# Altium schematic sheet Sheet1.SchDoc: 8-Port USB Video Switch
size B; Author: Micah Dowty; DrawnBy: Micah Dowty; Revision: A
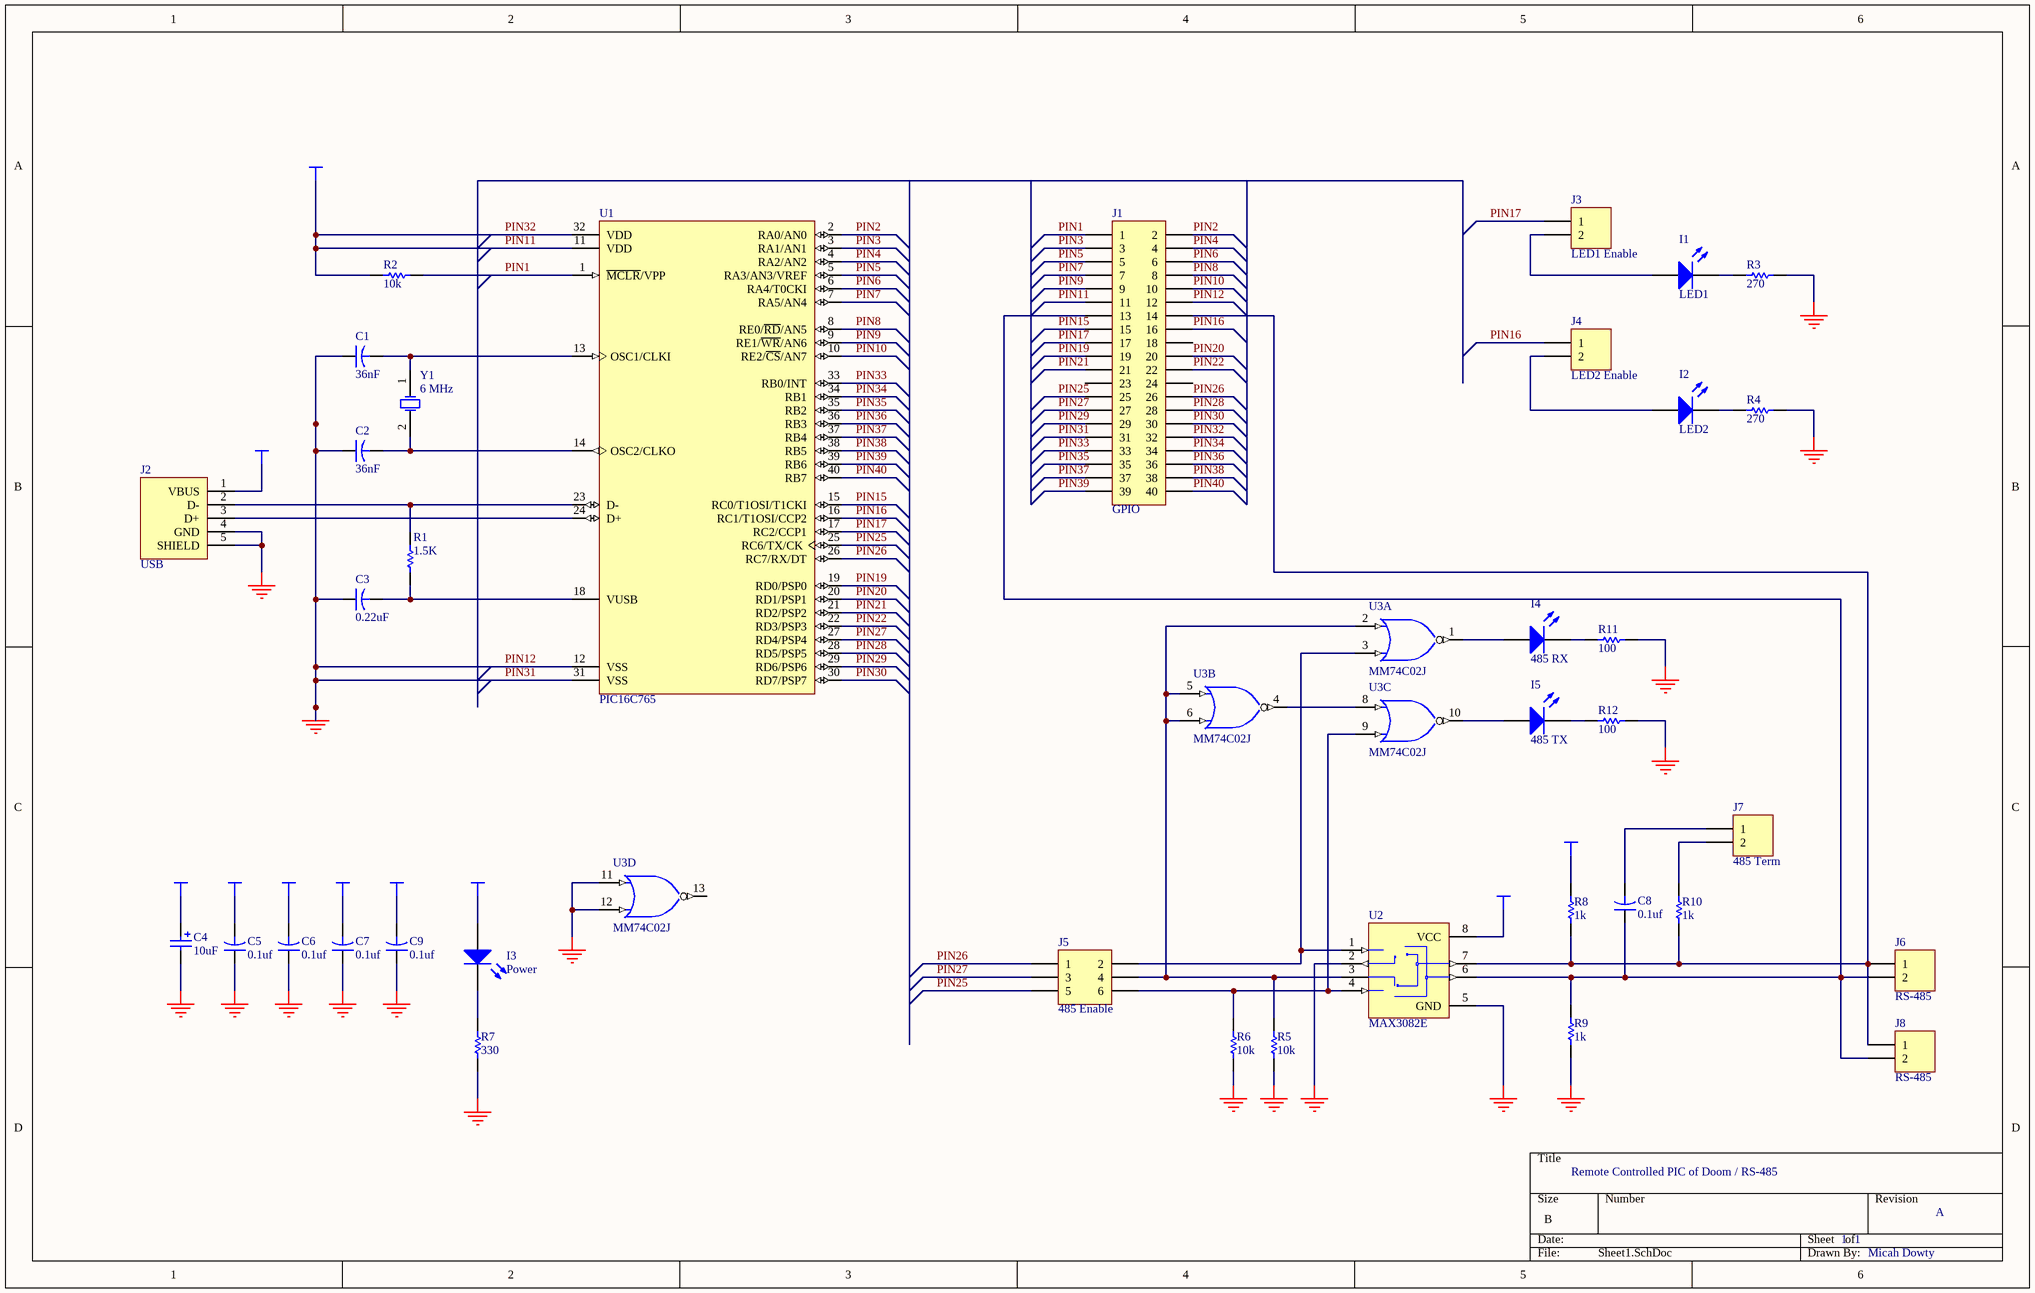
[diagram p0: Sheet1.SchDoc]

## Parts
C1  value 36nF  [CAPR5-4X5]  (hidden comment: Cap2)
C2  value 36nF  [CAPR5-4X5]  (hidden comment: Cap2)
C3  value 0.22uF  [CAPR5-4X5]
C4  10uF  [CAP-EE-1]
C5  value 0.1uf  [CAPR5-4X5]
C6  value 0.1uf  [CAPR5-4X5]
C7  value 0.1uf  [CAPR5-4X5]
C8  value 0.1uf  [CAPR5-4X5]
C9  value 0.1uf  [CAPR5-4X5]
I1  LED1  [LED-1-UNBROKE]
I2  LED2  [LED-1-UNBROKE]
I3  Power  [LED-1-UNBROKE]
I4  485 RX  [LED-1-UNBROKE]
I5  485 TX  [LED-1-UNBROKE]
J1  GPIO  [HR40]
J2  USB  [USB-TYPEB]
J3  LED1 Enable  [HDR1X2]
J4  LED2 Enable  [HDR1X2]
J5  485 Enable  [HDR2X3_NOTEXT]
J6  RS-485  [RS485J]
J7  485 Term  [HDR1X2]
J8  RS-485  [HDR1X2]
R1  value 1.5K  [AXIAL-0.3]  (hidden comment: Res1)
R2  value 10k  [AXIAL-0.3]  (hidden comment: Res1)
R3  value 270  [AXIAL-0.3]  (hidden comment: Res1)
R4  value 270  [AXIAL-0.3]  (hidden comment: Res1)
R5  value 10k  [AXIAL-0.3]  (hidden comment: Res1)
R6  value 10k  [AXIAL-0.3]  (hidden comment: Res1)
R7  value 330  [AXIAL-0.3]
R8  value 1k  [AXIAL-0.3]
R9  value 1k  [AXIAL-0.3]
R10  value 1k  [AXIAL-0.3]
R11  value 100  [AXIAL-0.3]
R12  value 100  [AXIAL-0.3]
U1  PIC16C765  [DIP-40]
U2  MAX3082E  [DIP-8]
U3  MM74C02J  [DIP-14]  (parts A,B,C,D of 4)
Y1  6 MHz  [BCY-W2/E4.7]

## Nets
PIN11: C4.1 C5.2 C6.2 C7.2 C9.2 I3.1(A) J1.11 J1.32 J2.1(VBUS) R2.2 R8.1 U1.11(VDD) U1.32(VDD) U2.8(VCC) U3.14(VCC)  [also labelled PIN32, VCC]
PIN12: C1.1 C2.1 C3.1 C4.2 C5.1 C6.1 C7.1 C9.1 J1.12 J1.31 J2.4(GND) J2.5(SHIELD) R3.2 R4.2 R5.1 R6.1 R7.2 R9.2 R11.2 R12.2 U1.12(VSS) U1.31(VSS) U2.2(~{RE}) U2.5(GND) U3.7(GND) U3.11(A) U3.12(B)  [also labelled GND, PIN31]
PIN1: J1.1 R2.1 U1.1(~{MCLR}/VPP)
PIN2: J1.2 U1.2(RA0/AN0)
PIN3: J1.3 U1.3(RA1/AN1)
PIN4: J1.4 U1.4(RA2/AN2)
PIN5: J1.5 U1.5(RA3/AN3/VREF)
PIN6: J1.6 U1.6(RA4/T0CKI)
PIN7: J1.7 U1.7(RA5/AN4)
PIN8: J1.8 U1.8(RE0/~{RD}/AN5)
PIN9: J1.9 U1.9(RE1/~{WR}/AN6)
PIN10: J1.10 U1.10(RE2/~{CS}/AN7)
PIN15: J1.15 U1.15(RC0/T1OSI/T1CKI)
PIN16: J1.16 J4.1 U1.16(RC1/T1OSI/CCP2)
PIN17: J1.17 J3.1 U1.17(RC2/CCP1)
PIN19: J1.19 U1.19(RD0/PSP0)
PIN20: J1.20 U1.20(RD1/PSP1)
PIN21: J1.21 U1.21(RD2/PSP2)
PIN22: J1.22 U1.22(RD3/PSP3)
PIN25: J1.25 J5.5 U1.25(RC6/TX/CK)
PIN26: J1.26 J5.1 U1.26(RC7/RX/DT)
PIN27: J1.27 J5.3 U1.27(RD4/PSP4)
PIN28: J1.28 U1.28(RD5/PSP5)
PIN29: J1.29 U1.29(RD6/PSP6)
PIN30: J1.30 U1.30(RD7/PSP7)
PIN33: J1.33 U1.33(RB0/INT)
PIN34: J1.34 U1.34(RB1)
PIN35: J1.35 U1.35(RB2)
PIN36: J1.36 U1.36(RB3)
PIN37: J1.37 U1.37(RB4)
PIN38: J1.38 U1.38(RB5)
PIN39: J1.39 U1.39(RB6)
PIN40: J1.40 U1.40(RB7)
NetC1_2: C1.2 U1.13(OSC1/CLKI) Y1.1(OSC1)
NetC2_2: C2.2 U1.14(OSC2/CLKO) Y1.2(OSC2)
NetC3_2: C3.2 R1.1 U1.18(VUSB)
NetC8_1: C8.1 J1.13 J1.14 J6.1 J6.2 J8.1 J8.2 R8.2 R9.1 R10.2 U2.6(T2OUT) U2.7(T1OUT)
NetC8_2: C8.2 J7.1
NetI1_1: I1.1(A) J3.2
NetI1_2: I1.2(K) R3.1
NetI2_1: I2.1(A) J4.2
NetI2_2: I2.2(K) R4.1
NetI3_2: I3.2(K) R7.1
NetI4_1: I4.1(A) U3.1(Y)
NetI4_2: I4.2(K) R11.1
NetI5_1: I5.1(A) U3.10(Y)
NetI5_2: I5.2(K) R12.1
NetJ2_2: J2.2(D-) R1.2 U1.23(D-)
NetJ2_3: J2.3(D+) U1.24(D+)
NetJ5_2: J5.2 U2.1(RO) U3.3(B)
NetJ5_4: J5.4 R5.2 U2.3(DE) U3.2(A) U3.5(A) U3.6(B)
NetJ5_6: J5.6 R6.2 U2.4(DI) U3.9(B)
NetJ7_2: J7.2 R10.1
NetU3_4: U3.4(Y) U3.8(A)

Not connected (* = marked no-connect by the designer): J1 18 23 24; U3 13(Y)

## Notes on the sheet
- Remote Controlled PIC of Doom / RS-485
- 1
- A
- Micah Dowty

## Library data of the parts
C1-C3 C5-C9 = Cap2: Capacitor; Manufacturer: Generic Components; Class I: Passive; Published: 23-Sep-2002; Publisher: Altium Limited; Class II: Capacitor
C4 = Cap Pol1: Polarized Capacitor (Radial); Manufacturer: Generic Components; Class I: Passive; Published: 8-Jun-2000; Revision: July-2002: Re-released for DXP Platform.; Publisher: Altium Limited; Class II: Capacitor; Value: 10uF
I1-I5 = LED1: Typical RED GaAs LED; Manufacturer: Generic Components; Class I: Optoelectronic; Published: 8-Jun-2000; Revision: July-2002: Re-released for DXP Platform.; Publisher: Altium Limited; Class II: LED
J1 = MHDR2X20: Header, 20-Pin, Dual row; Manufacturer: Generic Components; Class I: Connector; Revision: July-2002: Re-released for DXP Platform.; Publisher: Altium Limited
J2 = USB Type B: Header, 4-Pin; Manufacturer: Generic Components; Class I: Connector; Revision: July-2002: Re-released for DXP Platform.; Publisher: Altium Limited
J3 J4 J6-J8 = MHDR1X2: Header, 2-Pin; Manufacturer: Generic Components; Class I: Connector; Revision: July-2002: Re-released for DXP Platform.; Publisher: Altium Limited
J5 = MHDR2X3: Header, 3-Pin, Dual row; Manufacturer: Generic Components; Class I: Connector; Revision: July-2002: Re-released for DXP Platform.; Publisher: Altium Limited
R1-R12 = Res1: Resistor; Manufacturer: Generic Components; Class I: Passive; Published: 8-Jun-2000; Revision: July-2002: Re-released for DXP Platform.; Publisher: Altium Limited; Class II: Resistor
U1 = PIC16C765: EPROM-Based 8-Bit CMOS Microcontroller with USB; Manufacturer: Microchip; Revision: Modified for PIC16C745 by Micah Dowty; Package Reference: P40; Class I: Microcontroller; Class II: 8-bit
U2 = MAX3082E: +5V-Powered, RS-485 Driver/Receiver; Manufacturer: Maxim; Class I: Communication; Class II: Transceiver; Revision: initially drawn; Publisher: Micah Dowty
U3 = MM74C02J: Quad 2-Input NOR Gate; Manufacturer: National Semiconductor; Class I: Logic; Published: 15-Apr-2002; Datasheet: Latest Revision: Feb-1988; Package Reference: J14A; Publisher: Altium Limited; Class II: Gate
Y1 = XTAL: Crystal Oscillator; Manufacturer: Generic Components; Published: 8-Jun-2000; Revision: July-2002: Re-released for DXP Platform.; Publisher: Altium Limited; Class I: Oscillator; Class II: Crystal Oscillator